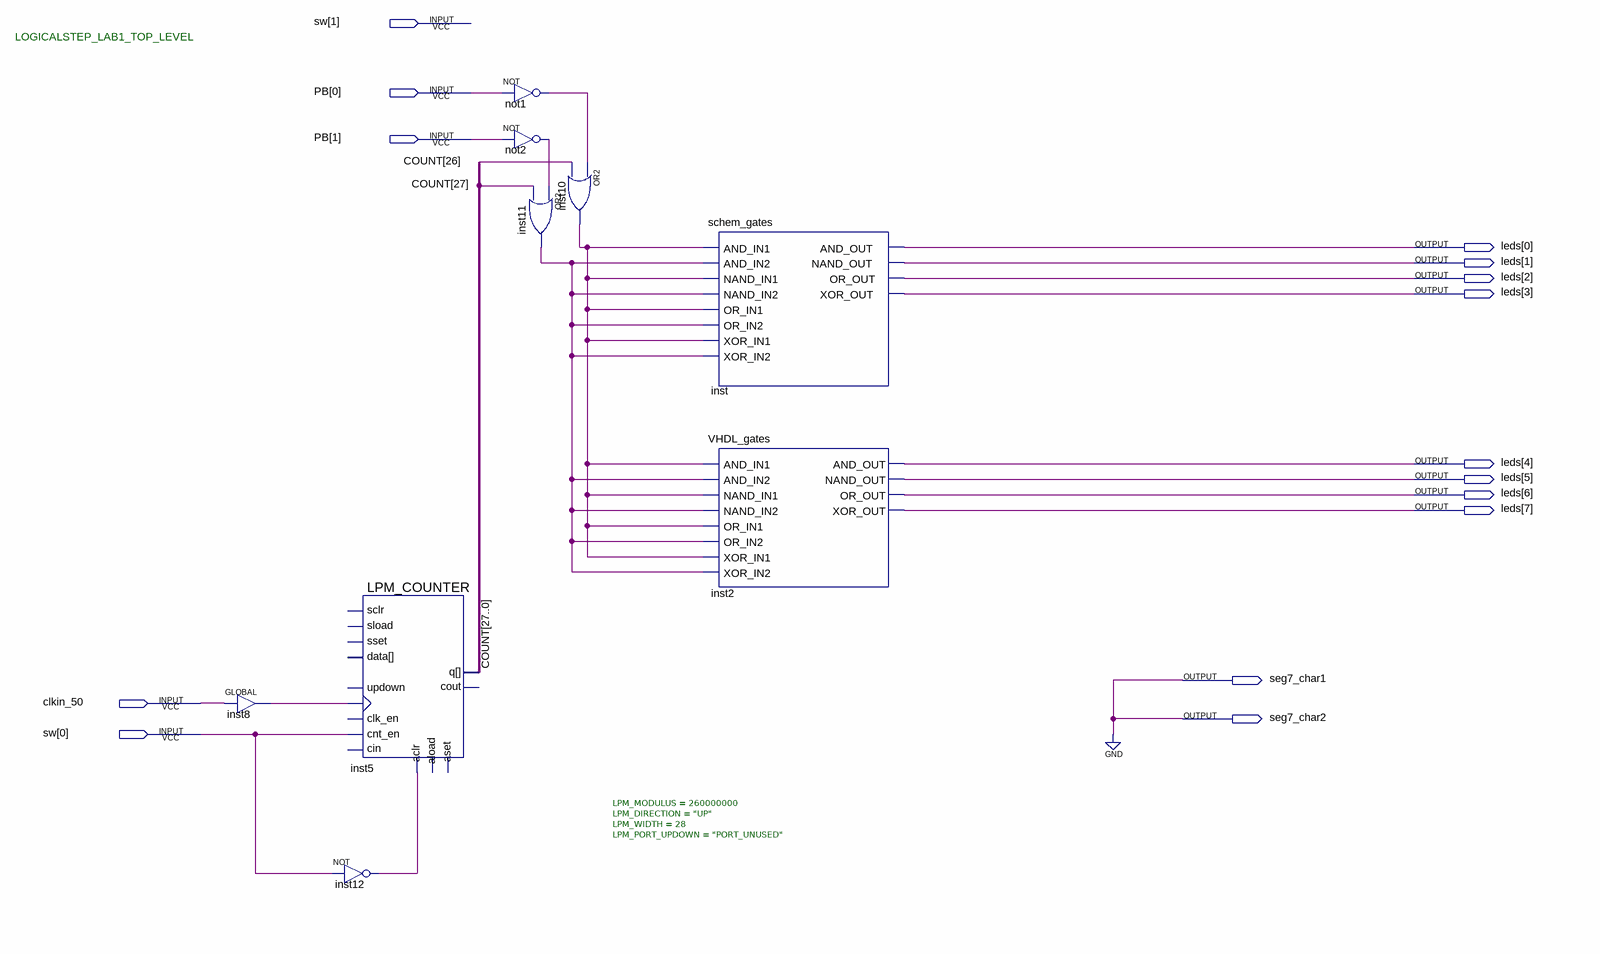
[diagram p0: schematic sheet]
// Quartus schematic LogicalStep_Lab1_top.bdf as structural Verilog: 9 symbols, 15 pins
module LogicalStep_Lab1_top (
  input  [1:0] sw,
  input  [1:0] PB,
  input  clkin_50,
  output [7:0] leds,
  output seg7_char1,
  output seg7_char2
);

  wire inst8_out, inst10_out, inst11_out, inst12_out, not1_out, not2_out;
  wire [27:0] COUNT;

  GLOBAL inst8 (.IN(clkin_50), .OUT(inst8_out));
  LPM_COUNTER #(.LPM_MODULUS(260000000), .LPM_DIRECTION("UP"), .LPM_WIDTH(28), .LPM_PORT_UPDOWN("PORT_UNUSED")) inst5 (
    .clock(inst8_out), .aclr(inst12_out), .cnt_en(sw[0]), .q(COUNT));  // open: sload, data, clk_en, aload, aset, cin, sset, updown, sclr, cout
  not inst12 (inst12_out, sw[0]);
  not not1 (not1_out, PB[0]);
  not not2 (not2_out, PB[1]);
  or inst10 (inst10_out, not1_out, COUNT[26]);
  or inst11 (inst11_out, not2_out, COUNT[27]);
  schem_gates inst (
    .AND_IN1(inst10_out), .AND_IN2(inst11_out), .NAND_IN1(inst10_out), .NAND_IN2(inst11_out),
    .OR_IN1(inst10_out), .OR_IN2(inst11_out), .XOR_IN1(inst10_out), .XOR_IN2(inst11_out), .AND_OUT(leds[0]),
    .NAND_OUT(leds[1]), .OR_OUT(leds[2]), .XOR_OUT(leds[3]));
  VHDL_gates inst2 (
    .AND_IN1(inst10_out), .AND_IN2(inst11_out), .NAND_IN1(inst10_out), .NAND_IN2(inst11_out),
    .OR_IN1(inst10_out), .OR_IN2(inst11_out), .XOR_IN1(inst10_out), .XOR_IN2(inst11_out), .AND_OUT(leds[4]),
    .NAND_OUT(leds[5]), .OR_OUT(leds[6]), .XOR_OUT(leds[7]));

  assign seg7_char1 = 1'b0;
  assign seg7_char2 = 1'b0;

  // Notes on the sheet:
  //   LOGICALSTEP_LAB1_TOP_LEVEL
endmodule
